# Altium project watch_V2.PrjPcb
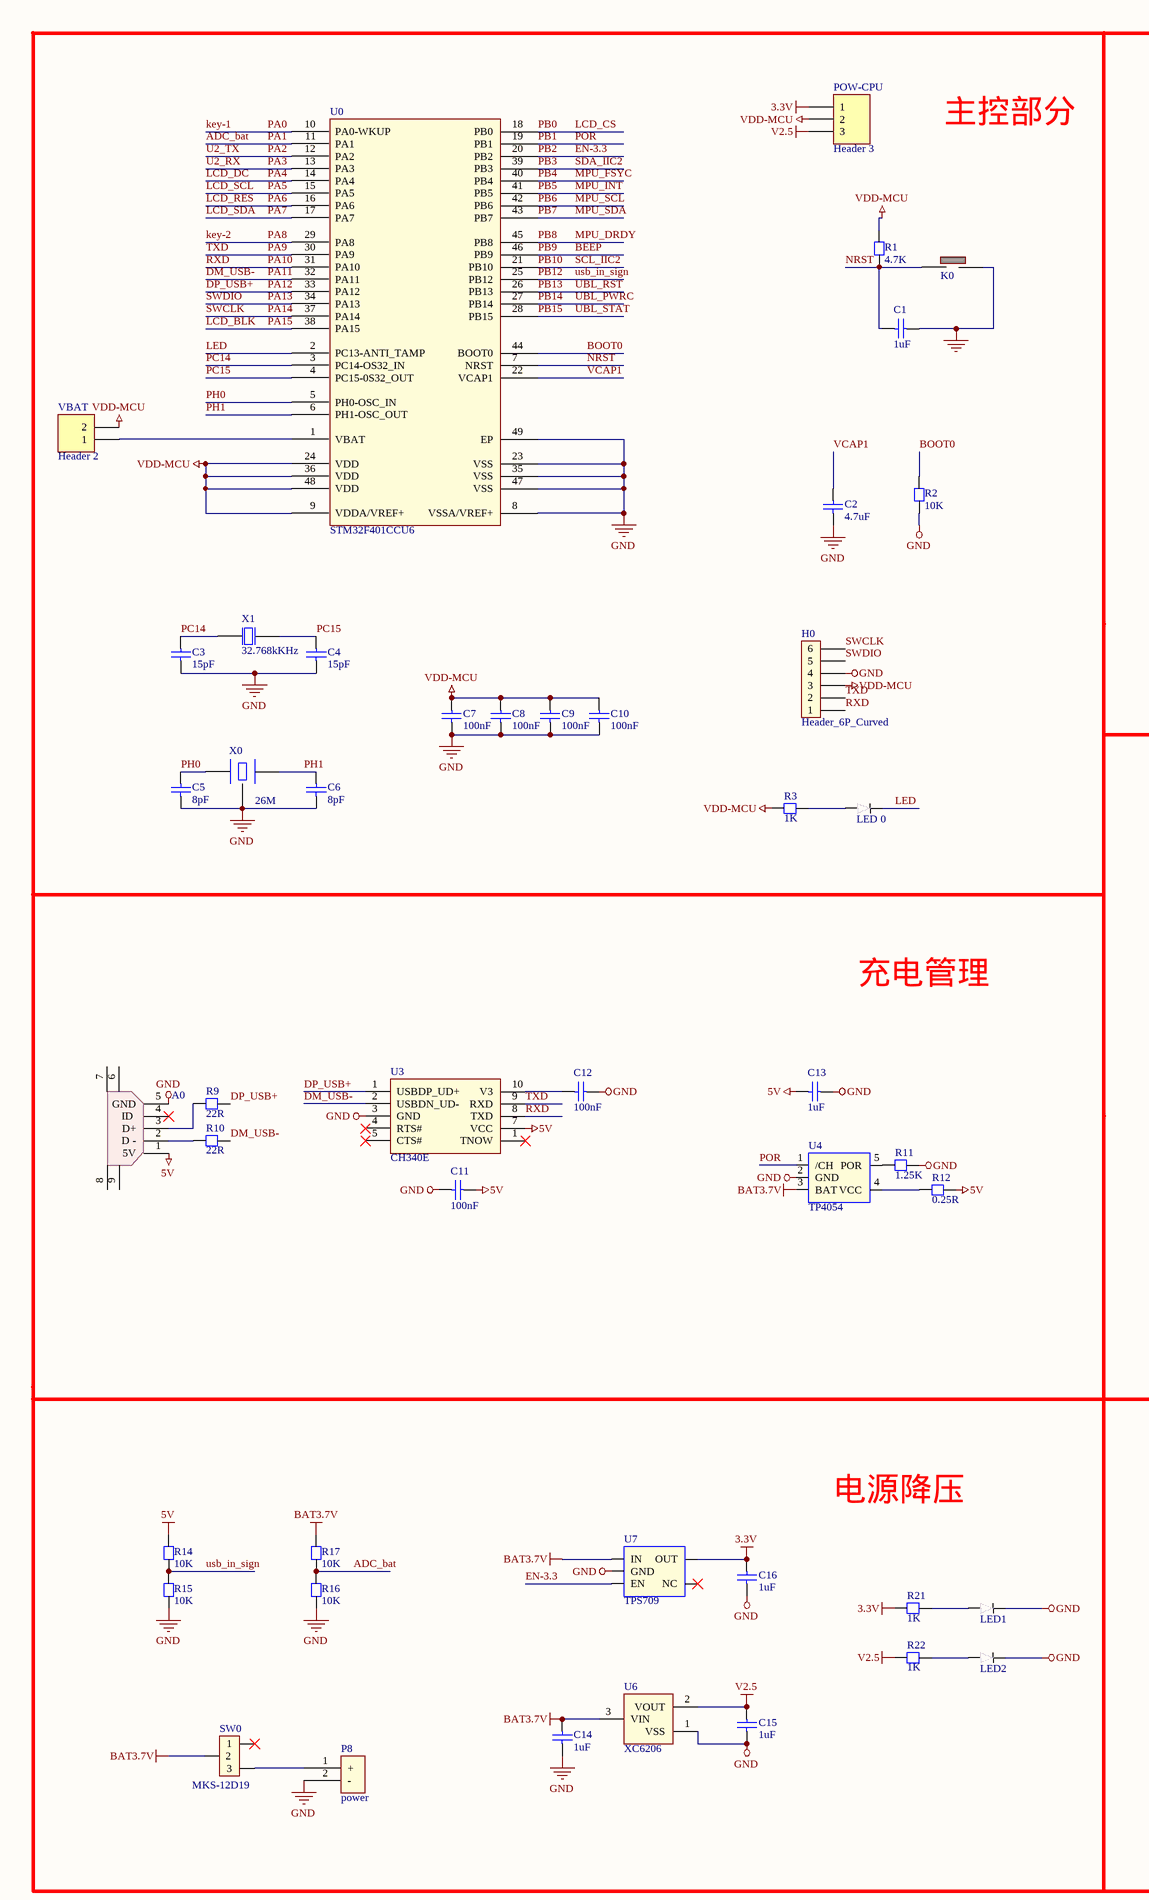
[diagram p0: Sheet-watch.SchDoc, left]
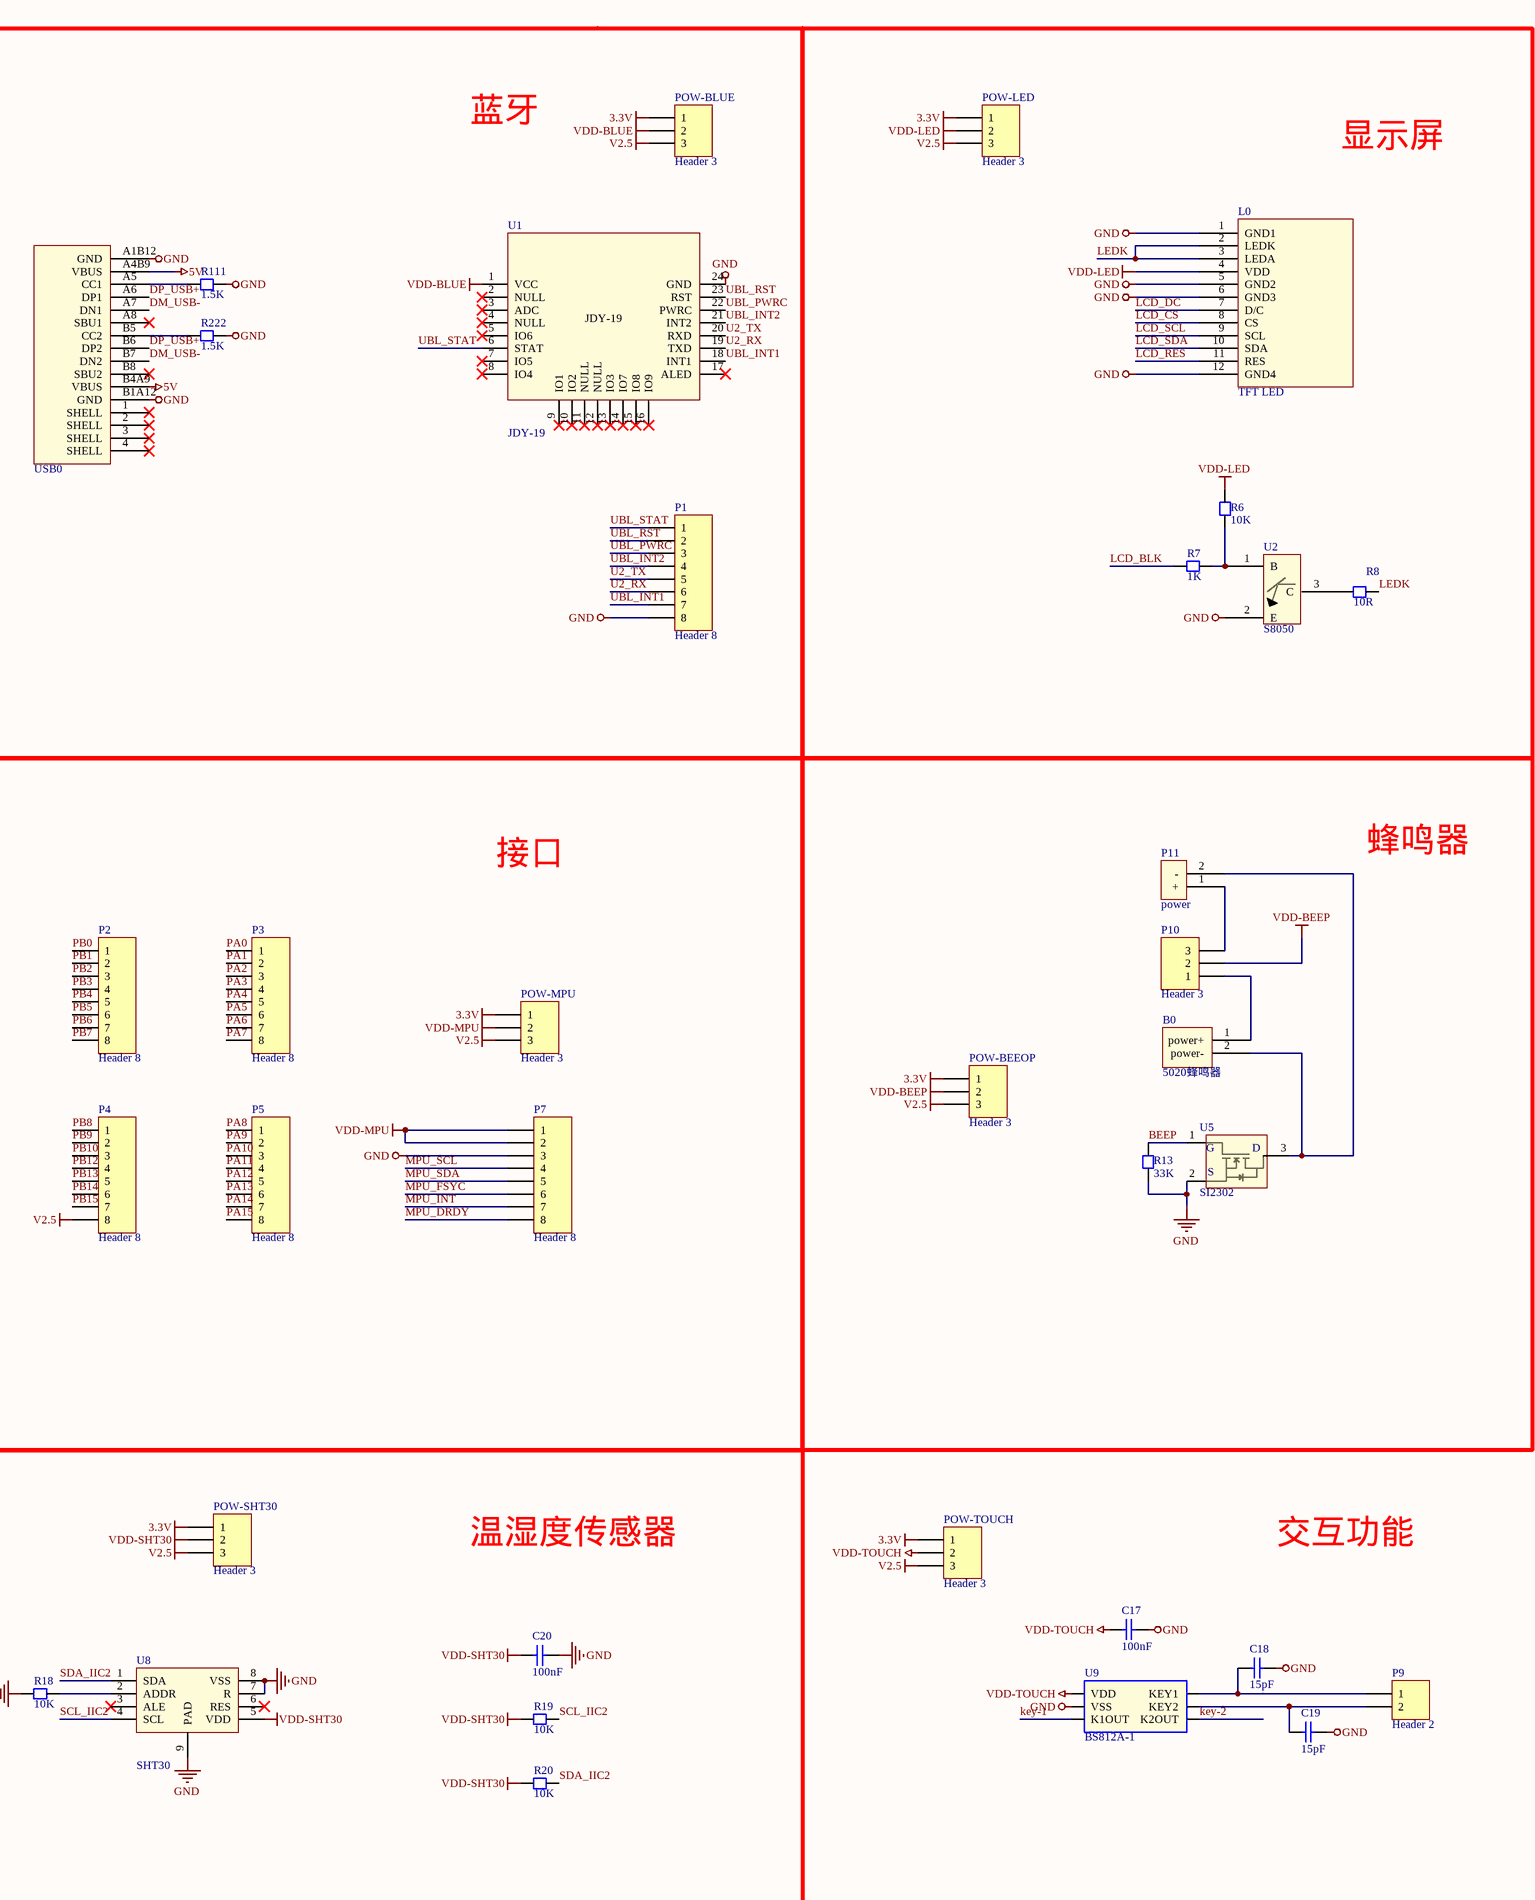
[diagram p1: Sheet-watch.SchDoc, right]
1 sheet, 82 parts. Net scope: global (net labels, ports and power ports of the same name join across sheets).
Board file: PCB-watch.PcbDoc

## Sheet Sheet-watch.SchDoc
size A2; Organization: Protel International P/L; Address1: L3, 12a Rodborough Rd; Address2: Frenchs Forest; Address3: NSW; Address4: Australia 2086

### Parts
A0  Micro USB  [Micro usb AB]  (value not drawn)
B0  5020蜂鸣器  [5020蜂鸣器]
C1  1uF  [CC1608-0603]
C2  4.7uF  [CC1608-0603]
C3  15pF  [CC1608-0603]
C4  15pF  [CC1608-0603]
C5  8pF  [CC1608-0603]
C6  8pF  [CC1608-0603]
C7  100nF  [CC1608-0603]
C8  100nF  [CC1608-0603]
C9  100nF  [CC1608-0603]
C10  100nF  [CC1608-0603]
C11  100nF  [CC1608-0603]
C12  100nF  [CC1608-0603]
C13  1uF  [CC1608-0603]
C14  1uF  [CC1608-0603]
C15  1uF  [CC1608-0603]
C16  1uF  [CC1608-0603]
C17  100nF  [CC1608-0603]
C18  15pF  [CC1608-0603]
C19  15pF  [CC1608-0603]
C20  100nF  [CC1608-0603]
H0  Header_6P_Curved  [Header_2_54_6PW]
K0  KEY 3*4  [KEY 3*4]  (value not drawn)
L0  TFT LED  [LCD-1.3-(2)]
LED1  LED 0603  [LED 0603]  (value not drawn)
LED2  LED 0603  [LED 0603]  (value not drawn)
LED_0  LED 0603  [LED 0603]  (value not drawn)
P1  Header 8  [HDR1X8]
P2  Header 8  [HDR1X8]
P3  Header 8  [HDR1X8]
P4  Header 8  [HDR1X8]
P5  Header 8  [HDR1X8]
P7  Header 8  [HDR1X8]
P8  power  [POWER-3.7V]
P9  Header 2  [HDR1X2]
P10  Header 3  [HDR1X3]
P11  power  [POWER-3.7V]
POW-BEEOP  Header 3  [HDR1X3]
POW-BLUE  Header 3  [HDR1X3]
POW-CPU  Header 3  [HDR1X3]
POW-LED  Header 3  [HDR1X3]
POW-MPU  Header 3  [HDR1X3]
POW-SHT30  Header 3  [HDR1X3]
POW-TOUCH  Header 3  [HDR1X3]
R1  4.7K  [CR1608-0603]
R2  10K  [CR1608-0603]
R3  1K  [CR1608-0603]
R6  10K  [CR1608-0603]
R7  1K  [CR1608-0603]
R8  10R  [CR1608-0603]
R9  22R  [CR1608-0603]
R10  22R  [CR1608-0603]
R11  1.25K  [CR1608-0603]
R12  0.25R  [CR1608-0603]
R13  33K  [CR1608-0603]
R14  10K  [CR1608-0603]
R15  10K  [CR1608-0603]
R16  10K  [CR1608-0603]
R17  10K  [CR1608-0603]
R18  10K  [CR1608-0603]
R19  10K  [CR1608-0603]
R20  10K  [CR1608-0603]
R21  1K  [CR1608-0603]
R22  1K  [CR1608-0603]
R111  1.5K  [CR1608-0603]
R222  1.5K  [CR1608-0603]
SW0  MKS-12D19  [SW  MSK-02]
U0  STM32F401CCU6  [STM32-UFQFPN48_N]
U1  JDY-19  [JDY-19]
U2  S8050  [SOT-23 SI2302]
U3  CH340E  [MSOP-10]
U4  TP4054  [SOT23-5]
U5  SI2302  [SOT-23 SI2302]
U6  XC6206  [SOT-23 SI2302]
U7  TPS709  [SOT23-5]
U8  SHT30  [SHT3X-DIS]
U9  BS812A-1  [SOT23-6]
USB0  Tpye-c 16P  [TYPE-C 16P]  (value not drawn)
VBAT  Header 2  [HDR1X2]
X0  26M  [XTAL-3225]
X1  32.768kKHz  [XTAL-3215]

### Blocks framed on the sheet
主控部分: C1-C10 H0 K0 LED_0 POW-CPU R1-R3 U0 VBAT X0 X1
蓝牙: P1 POW-BLUE R111 R222 U1 USB0
充电管理: A0 C11-C13 R9-R12 U3 U4

### Nets
3.3V: C16.2 POW-BEEOP.1 POW-BLUE.1 POW-CPU.1 POW-LED.1 POW-MPU.1 POW-SHT30.1 POW-TOUCH.1 R21.2 U7.5(OUT)
5V: A0.1(5V) C11.1 C13.2 R12.1 R14.1 U3.7(VCC) USB0.A4B9(VBUS) USB0.B4A9(VBUS)
BAT3.7V: C14.2 R17.2 SW0.2 U4.3(BAT) U6.3(VIN) U7.1(IN)
GND: A0.5(GND) C1.1 C2.1 C3.1 C4.1 C5.1 C6.1 C7.1 C8.1 C9.1 C10.1 C11.2 C12.1 C13.1 C14.1 C15.1 C16.1 C17.1 C18.1 C19.1 C20.1 H0.4 K0.2 L0.1(GND1) L0.5(GND2) L0.6(GND3) L0.12(GND4) LED1.2 LED2.2 P1.8 P7.3 P8.2(-) R2.2 R11.1 R13.2 R15.2 R16.1 R18.1 R111.1 R222.1 U0.8(VSSA/VREF+) U0.23(VSS) U0.35(VSS) U0.47(VSS) U0.49(EP) U1.24(GND) U2.2(E) U3.3(GND) U4.2(GND) U5.2(SOURCE) U6.1(VSS) U7.2(GND) U8.7(R) U8.8(VSS) U8.9(PAD) U9.2(VSS) USB0.A1B12(GND) USB0.B1A12(GND) X0.2(GND)
V2.5: C15.2 P4.8 POW-BEEOP.3 POW-BLUE.3 POW-CPU.3 POW-LED.3 POW-MPU.3 POW-SHT30.3 POW-TOUCH.3 R22.2 U6.2(VOUT)
VDD-BEEP: P10.2 POW-BEEOP.2
VDD-BLUE: POW-BLUE.2 U1.1(VCC)
VDD-LED: L0.4(VDD) POW-LED.2 R6.1
VDD-MCU: C7.2 C8.2 C9.2 C10.2 H0.3 POW-CPU.2 R1.2 R3.2 U0.9(VDDA/VREF+) U0.24(VDD) U0.36(VDD) U0.48(VDD) VBAT.2
VDD-MPU: P7.1 P7.2 POW-MPU.2
VDD-SHT30: C20.2 POW-SHT30.2 R19.1 R20.1 U8.5(VDD)
VDD-TOUCH: C17.2 POW-TOUCH.2 U9.1(VDD)
ADC_bat: P3.2 R16.2 R17.1 U0.11(PA1)  [also labelled PA1]
BEEP: P4.2 R13.1 U0.46(PB9) U5.1(GATE)  [also labelled PB9]
BOOT0: R2.1 U0.44(BOOT0)
DM_USB-: P5.4 R10.1 U0.32(PA11) U3.2(USBDN_UD-) USB0.A7(DN1) USB0.B7(DN2)  [also labelled PA11]
DP_USB+: P5.5 R9.1 U0.33(PA12) U3.1(USBDP_UD+) USB0.A6(DP1) USB0.B6(DP2)  [also labelled PA12]
EN-3.3: P2.3 U0.20(PB2) U7.3(EN)  [also labelled PB2]
key-1: P3.1 U0.10(PA0-WKUP) U9.3(K1OUT)  [also labelled PA0]
key-2: P5.1 U0.29(PA8) U9.4(K2OUT)  [also labelled PA8]
LCD_BLK: P5.8 R7.2 U0.38(PA15)  [also labelled PA15]
LCD_CS: L0.8(CS) P2.1 U0.18(PB0)  [also labelled PB0]
LCD_DC: L0.7(D/C) P3.5 U0.14(PA4)  [also labelled PA4]
LCD_RES: L0.11(RES) P3.7 U0.16(PA6)  [also labelled PA6]
LCD_SCL: L0.9(SCL) P3.6 U0.15(PA5)  [also labelled PA5]
LCD_SDA: L0.10(SDA) P3.8 U0.17(PA7)  [also labelled PA7]
LED: LED_0.2 U0.2(PC13-ANTI_TAMP)
LEDK: L0.2(LEDK) L0.3(LEDA) R8.1
MPU_DRDY: P4.1 P7.8 U0.45(PB8)  [also labelled PB8]
MPU_FSYC: P2.5 P7.6 U0.40(PB4)  [also labelled PB4]
MPU_INT: P2.6 P7.7 U0.41(PB5)  [also labelled PB5]
MPU_SCL: P2.7 P7.4 U0.42(PB6)  [also labelled PB6]
MPU_SDA: P2.8 P7.5 U0.43(PB7)  [also labelled PB7]
NRST: C1.2 K0.1 R1.1 U0.7(NRST)
PA2: P1.5 P3.3 U0.12(PA2) U1.20(RXD)  [also labelled U2_TX]
PA3: P1.6 P3.4 U0.13(PA3) U1.19(TXD)  [also labelled U2_RX]
PA9: H0.2 P5.2 U0.30(PA9) U3.9(RXD)  [also labelled TXD]
PA10: H0.1 P5.3 U0.31(PA10) U3.8(TXD)  [also labelled RXD]
PA13: H0.5 P5.6 U0.34(PA13)  [also labelled SWDIO]
PA14: H0.6 P5.7 U0.37(PA14)  [also labelled SWCLK]
PB1: P2.2 U0.19(PB1) U4.1(/CH)  [also labelled POR]
PB3: P2.4 R20.2 U0.39(PB3) U8.1(SDA)  [also labelled SDA_IIC2]
PB10: P4.3 R19.2 U0.21(PB10) U8.4(SCL)  [also labelled SCL_IIC2]
PB12: P4.4 R14.2 R15.1 U0.25(PB12)  [also labelled usb_in_sign]
PB13: P1.2 P4.5 U0.26(PB13) U1.23(RST)  [also labelled UBL_RST]
PB14: P1.3 P4.6 U0.27(PB14) U1.22(PWRC)  [also labelled UBL_PWRC]
PB15: P1.1 P4.7 U0.28(PB15) U1.6(STAT)  [also labelled UBL_STAT]
PC14: C3.2 U0.3(PC14-OS32_IN) X1.1(OSC1)
PC15: C4.2 U0.4(PC15-0S32_OUT) X1.2(OSC2)
PH0: C5.2 U0.5(PH0-OSC_IN) X0.1(OSC1)
PH1: C6.2 U0.6(PH1-OSC_OUT) X0.3(OSC2)
UBL_INT1: P1.7 U1.18(INT1)
UBL_INT2: P1.4 U1.21(INT2)
VCAP1: C2.2 U0.22(VCAP1)
NetA0_2: A0.2(D_-) R10.2
NetA0_3: A0.3(D+) R9.2
NetB0_1: B0.1(power+) P10.1
NetB0_2: B0.2(power-) P11.2(-) U5.3(DRAIN)
NetC12_2: C12.2 U3.10(V3)
NetC18_2: C18.2 P9.1 U9.6(KEY1)
NetC19_2: C19.2 P9.2 U9.5(KEY2)
NetLED1_1: LED1.1 R21.1
NetLED2_1: LED2.1 R22.1
NetLED_0_1: LED_0.1 R3.1
NetP8_1: P8.1(+) SW0.3
NetP10_3: P10.3 P11.1(+)
NetR6_2: R6.2 R7.1 U2.1(B)
NetR8_2: R8.2 U2.3(C)
NetR11_2: R11.2 U4.5(POR)
NetR12_2: R12.2 U4.4(VCC)
NetR18_2: R18.2 U8.2(ADDR)
NetR111_2: R111.2 USB0.A5(CC1)
NetR222_2: R222.2 USB0.B5(CC2)
NetU0_1: U0.1(VBAT) VBAT.1

Not connected (* = marked no-connect by the designer): A0 4(ID_)* 6 7 8 9; SW0 1*; U1 2(NULL)* 3(ADC)* 4(NULL)* 5(IO6)* 7(IO5)* 8(IO4)* 9(IO1)* 10(IO2)* 11(NULL)* 12(NULL)* 13(IO3)* 14(IO7)* 15(IO8)* 16(IO9)* 17(ALED)*; U3 4(RTS#)* 5(CTS#)*; U7 4(NC)*; U8 3(ALE)* 6(RES)*; USB0 1(SHELL)* 2(SHELL)* 3(SHELL)* 4(SHELL)* A8(SBU1)* B8(SBU2)*

### Notes on the sheet
- 显示屏
- 接口
- 蜂鸣器
- 电源降压
- 温湿度传感器
- 交互功能
- Title
- Size:
- Date:
- File:
- A2
- Number:
- Time:
- Revision:
- Sheet
- of
- (in symbol SI2302) G; D; S

### Library data of the parts
A0 = Micro USB: 迷你usb接口
B0 = 5020蜂鸣器: 蜂鸣器，贴片封装，长宽5.2mm
C1-C20 = Cap Chip 0603: 电容; Published: 8-Jun-2000; Revision: July-2002: Re-released for DXP Platform.; Publisher: Altium Limited
H0 = Header_6P_Curved: 弯的6P排针
L0 = LCD-IPSscreen-1.3: 1.3寸显示屏幕
P1-P5 P7 = Header 8: Header, 8-Pin; LatestRevisionDate: 17-Jul-2002; LatestRevisionNote: Re-released for DXP Platform.; Publisher: Altium Limited
P9 VBAT = Header 2: Header, 2-Pin; LatestRevisionDate: 17-Jul-2002; LatestRevisionNote: Re-released for DXP Platform.; Publisher: Altium Limited
P10 POW-BEEOP POW-BLUE POW-CPU POW-LED POW-MPU POW-SHT30 POW-TOUCH = Header 3: Header, 3-Pin; LatestRevisionDate: 17-Jul-2002; LatestRevisionNote: Re-released for DXP Platform.; Publisher: Altium Limited
R1-R3 R6-R22 R111 R222 = Resistor Chip 0603: 电阻; Published: 8-Jun-2000; Revision: July-2002: Re-released for DXP Platform.; Publisher: Altium Limited
SW0 = sw-MSK-12D19
U0 = stm32F411CEU6: stm32单片机 主频100MHz
U1 = JDY-19: 超低功耗蓝牙 4.2 BLE 模块
U2 = S8050: 三极管放大管 NPN型三极管 大电流300ma
U3 = CH340E: usd转串口芯片 MSOP10封装
U4 = TP4054: 迷你充电IC SOT-23-5
U5 = SI2302: NMOS场效应MOS管 SOT-23
U6 = XC6206: 2.5V降压IC SOT-23封装
U7 = TPS709: 3.3V降压IC SOT23-5封装 最大输出150ma电流
U8 = SHT30: 温湿度传感器
U9 = BS812A-1: 触摸按键 两路 SOP23-6封装极简电路
USB0 = Tpye-c 16P: 16P 封装的TYPE -c接口 4固定插脚 双向
X0 = XTAL 3225: 3225封装的晶振
X1 = XTAL 3215 32.768kKHz: 3215封装的时钟晶振